# EAGLE design EVAL_USB4155 (EAGLE 7.7.0)
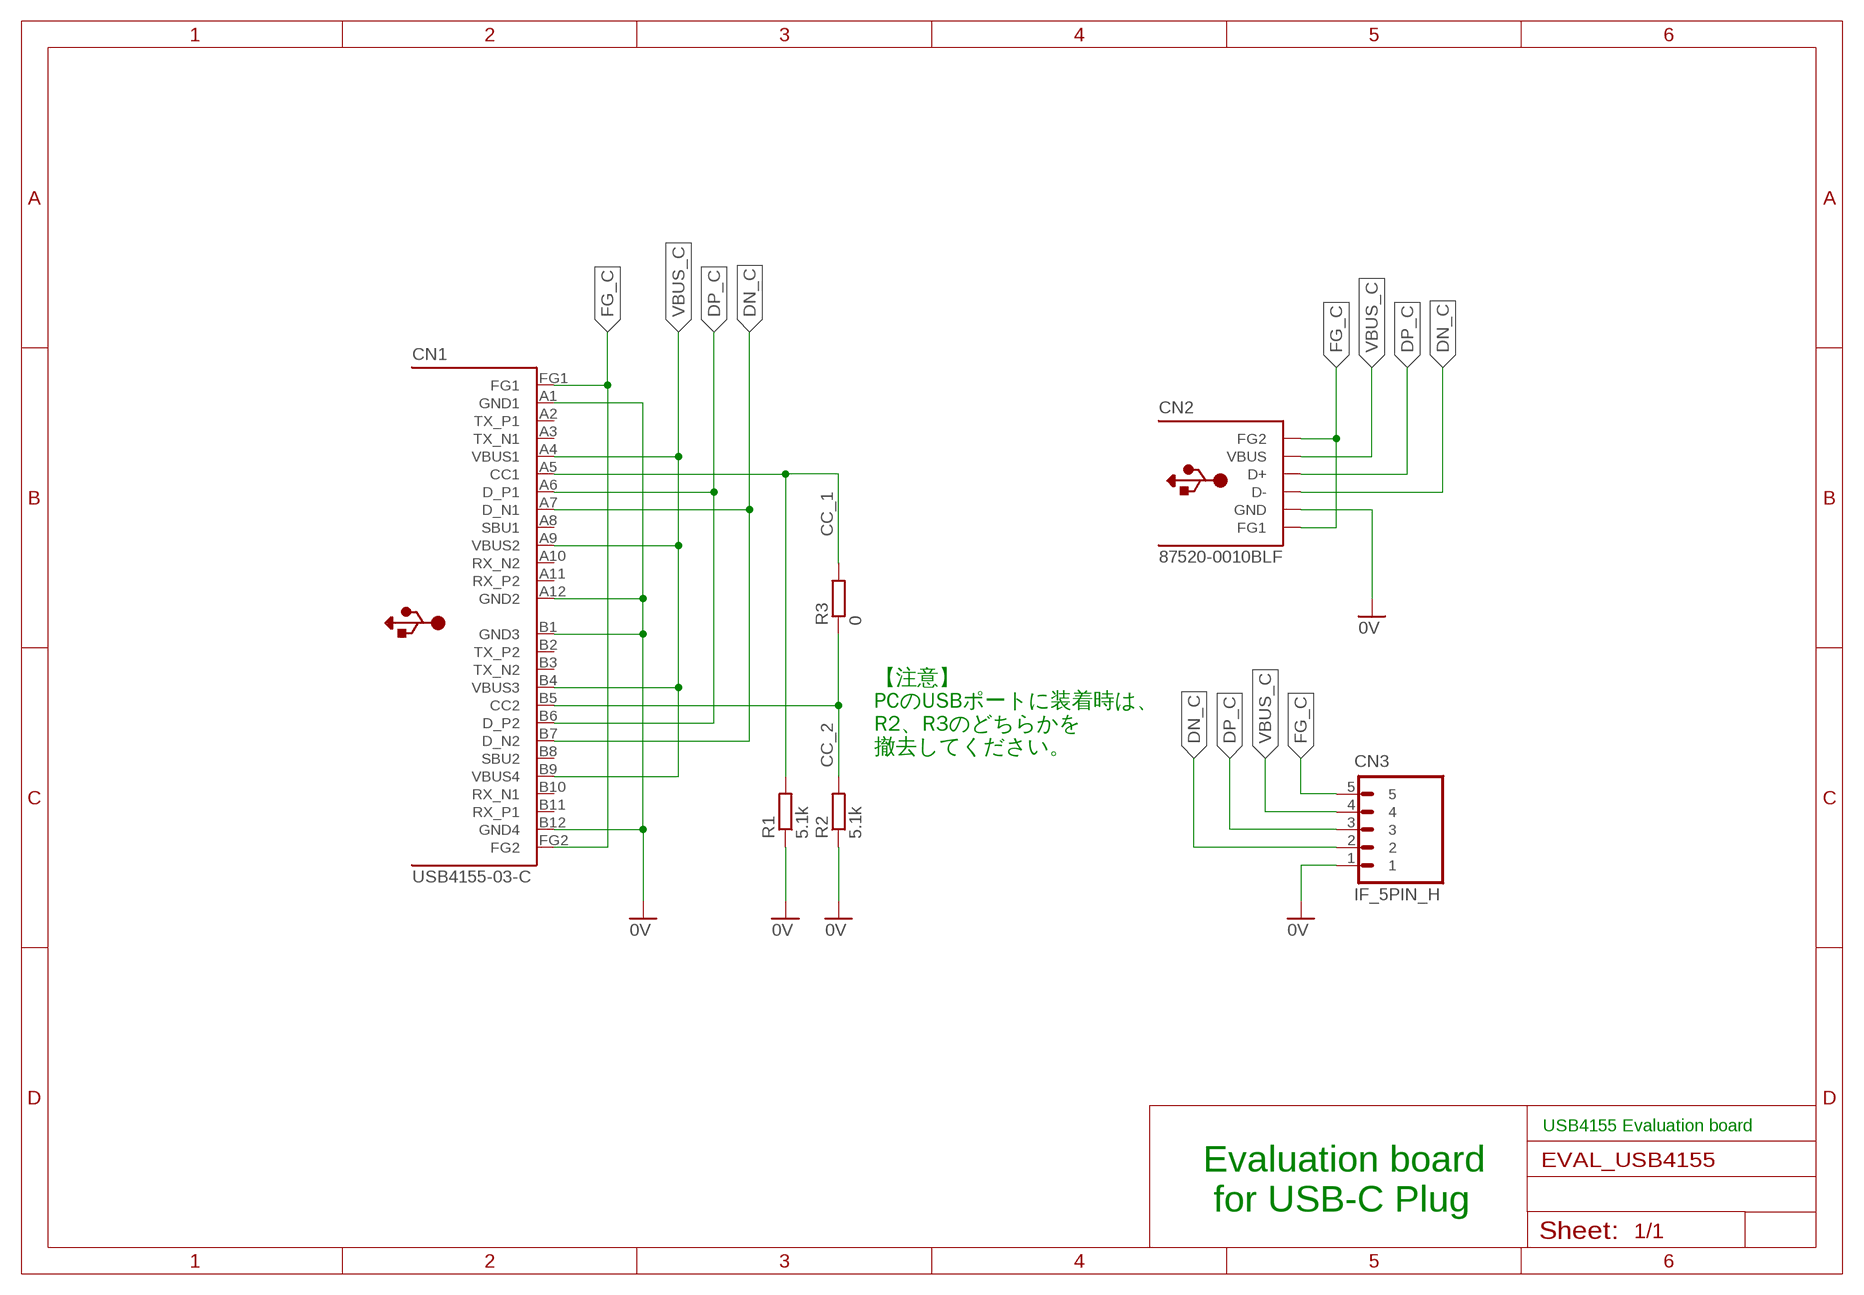
[diagram p0: schematic, sheet 1]

## Parts
CN1  USB4155-03-C  [USB4155-03-C]
CN2  87520-0010BLF  [87520-0010BLF]
CN3  IF_5PIN_H  [HEADER_5PIN]
R1  5.1k  RESISTOR_0402N  [R0402N]
R2  5.1k  RESISTOR_0402N  [R0402N]
R3  0  RESISTOR_0402N  [R0402N]

## Nets
0V: CN1.A1(GND1) CN1.A12(GND2) CN1.B1(GND3) CN1.B12(GND4) CN2.GND CN3.1 R1.1 R2.1
CC_1: CN1.A5(CC1) R1.2 R3.2
CC_2: CN1.B5(CC2) R2.2 R3.1
DN_C: CN1.A7(D_N1) CN1.B7(D_N2) CN2.D- CN3.2
DP_C: CN1.A6(D_P1) CN1.B6(D_P2) CN2.D+ CN3.3
FG_C: CN1.FG1 CN1.FG2 CN2.FG1 CN2.FG2 CN3.5
VBUS_C: CN1.A4(VBUS1) CN1.A9(VBUS2) CN1.B4(VBUS3) CN1.B9(VBUS4) CN2.VBUS CN3.4
Unconnected: CN1.A2(TX_P1) CN1.A3(TX_N1) CN1.A8(SBU1) CN1.A10(RX_N2) CN1.A11(RX_P2) CN1.B2(TX_P2) CN1.B3(TX_N2) CN1.B8(SBU2) CN1.B10(RX_N1) CN1.B11(RX_P1)

## Notes on the sheet
- 【注意】
  PCのUSBポートに装着時は、
  R2、R3のどちらかを
  撤去してください。
- USB4155 Evaluation board
- Evaluation board
   for USB-C Plug

## Library data of the parts
CN1 = Connectors:USB4155-03-C: USB3.2 Gen2 Type C Plug, Horizontal, SMT
CN2 = Connectors:87520-0010BLF: USB Type-A(TM) receptacle
CN3 = Connectors:IF_5PIN: 5-pin インターフェース
R1-R3 = Parts:RESISTOR: 抵抗器

## Board
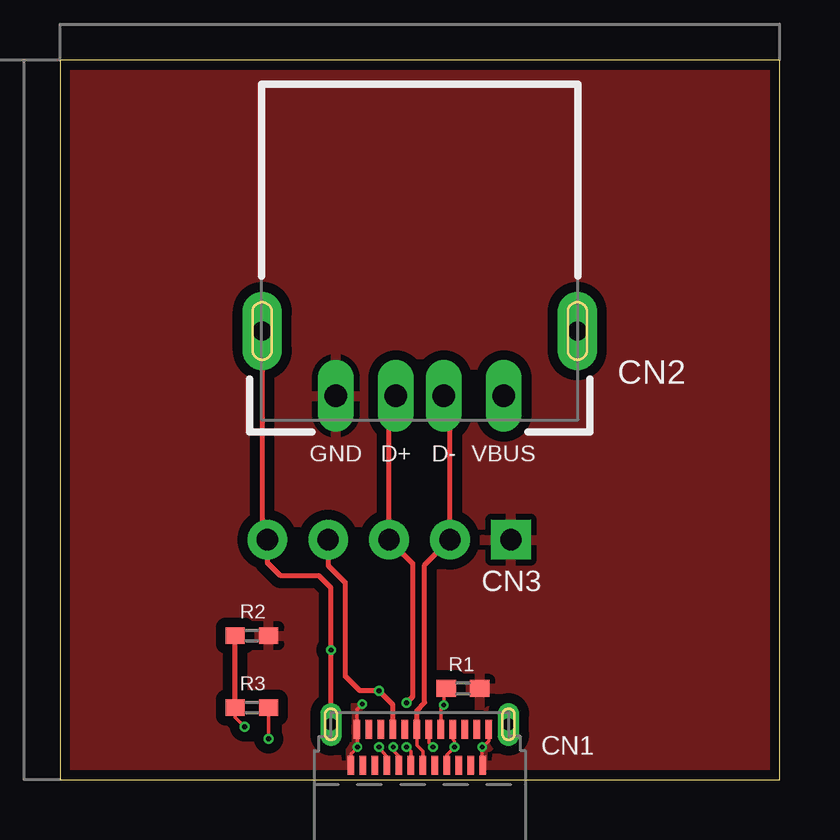
[diagram p1: board, top side]
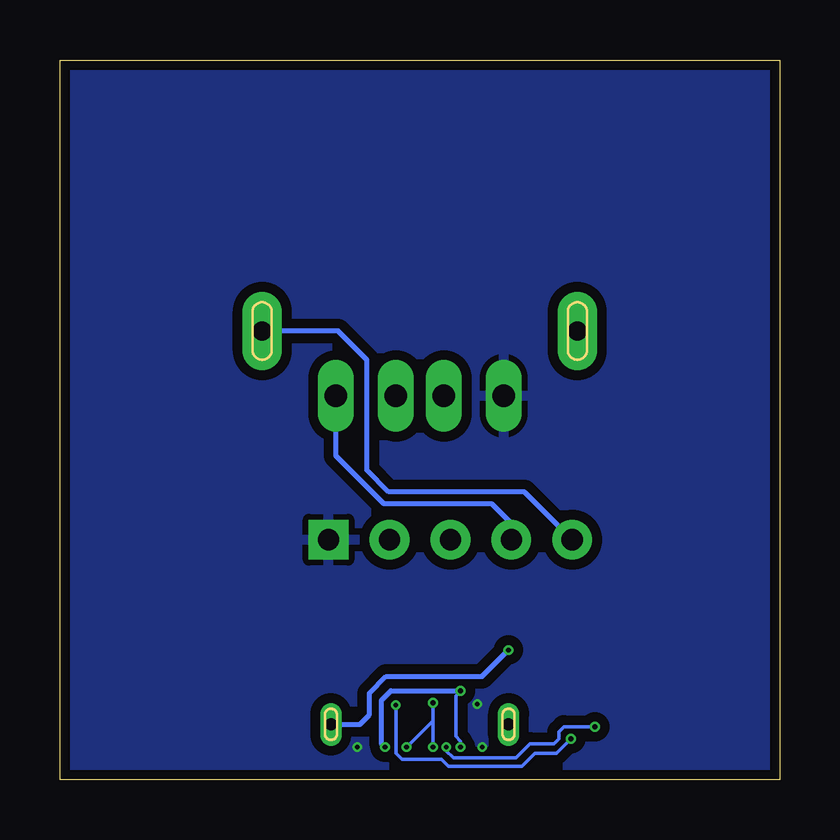
[diagram p2: board, bottom side, seen from below]

Size 30 x 30 mm. Coordinates in mm from the lower left corner, seen from the top.
Outline: 0,0 30,0 30,30 0,30 0,0
Copper layers (1*16): Top 0.035mm / dielectric 1.5mm / Bottom 0.035mm
Design rules "SeeedStudio_2layer_DRU_no_angle_20140221 *": minimum track width 6mil, minimum drill 0.2mm, track to track 0.15mm, track to pad 0.15mm, pad to pad 0.15mm, via to via 0.15mm, smd to smd 0mil, copper to edge 0.2mm, drill to drill 10mil, minimum pad ring 5mil, minimum via ring 0.1mm, stop-mask expansion 2mil, vias tented up to drill 100mil, thermal gap 10mil

### Footprints (pad centres in the part's own frame; a part is rotated, then mirrored left to right if it is on the bottom)
USB4155-03-C = smd 0.28 x 0.8: A1 2.875,2.1; A2 2.375,2.1; A3 1.875,2.1; A4 1.375,2.1; A5 0.875,2.1; A6 0.375,2.1; A7 -0.125,2.1; A8 -0.625,2.1; A9 -1.125,2.1; A10 -1.625,2.1; A11 -2.125,2.1; A12 -2.625,2.1; B1 -2.875,0.6; B2 -2.375,0.6; B3 -1.875,0.6; B4 -1.375,0.6; B5 -0.875,0.6; B6 -0.375,0.6; B7 0.125,0.6; B8 0.625,0.6; B9 1.125,0.6; B10 1.625,0.6; B11 2.125,0.6; B12 2.625,0.6 | drill 0.5 pad 0.9 long: FG1 3.7,2.3; FG2 -3.7,2.3
87520-0010BLF = drill 0.92 pad 1.5 long: D+ -1,0; D- 1,0; GND -3.5,0; VBUS 3.5,0 | drill 0.8 pad 1.64 long: FG1 -6.57,2.7; FG2 6.57,2.7
HEADER_5PIN = drill 0.889 pad 1.651 square: 1 0,0 | drill 0.889 pad 1.651: 2 2.54,0; 3 5.08,0; 4 7.62,0; 5 10.16,0
R0402N = smd 0.8 x 0.7: 1 -0.7,0; 2 0.7,0

### Placement (x,y rotation side)
CN1  15,0 0 top
CN2  15,16 0 top
CN3  18.8,10 180 top
R1  16.8,3.8 180 top
R2  8,6 180 top
R3  8,3 0 top

### Tracks (layer width: path | path; a pad name or v marks a point on that pad's centre or on a via)
0V  (via drill 0.2)
  Top 0.152: CN1.B12 17.6,0.62 v17.6,1.35 17.88,1.62 CN1.A1 | CN1.B1 12.12,1.07 v12.4,1.35 12.4,2.08 CN1.A12 12.38,2.92 v12.6,3.15
  pour Bottom (isolate 0.406, rank 3): -1,31 31,31 31,-1 -1,-1
  pour Top (isolate 0.406): -0.5,-0.5 30.5,-0.5 30.5,30.5 -0.5,30.5
CC_1  (via drill 0.2)
  Top 0.152: CN1.A5 15.88,2.98 v16,3.1 16,3.7 R1.2 | R3.2 v8.7,1.7
  Bottom 0.152: v16,3.1 16,1.1 15.75,0.85 14.1,0.85 13.8,0.55 10.75,0.55 10.2,1.1 9.3,1.1 v8.7,1.7
CC_2  (via drill 0.2)
  Top 0.152: CN1.B5 14.12,0.97 13.9,1.2 v13.9,1.35 | R3.1 7.3,2.6 v7.7,2.2
  Top 0.203: R3.1 R2.2
  Bottom 0.152: v13.9,1.35 13.9,1.2 13.6,0.9 11,0.9 10.4,1.5 9.4,1.5 9.2,1.7 9.2,2 9,2.2 v7.7,2.2
DN_C
  Top 0.152: CN1.B7 15.12,1.18 14.88,1.43 CN1.A7
  Top 0.203: CN1.A7 14.88,2.88 15.2,3.2 15.2,8.94 CN3.2 16.26,15.74 CN2.D-
DP_C  (via drill 0.2)
  Top 0.152: CN1.B6 14.62,1.18 v14.45,1.35 | v15.55,1.35 15.38,1.52 CN1.A6
  Top 0.203: CN2.D+ 13.72,15.72 CN3.3 14.7,9.02 14.7,3.45 v14.45,3.2
  Bottom 0.152: v14.45,3.2 14.45,2.45 | 14.45,2.45 v14.45,1.35 | v15.55,1.35 14.45,2.45
FG_C  (via drill 0.2)
  Top 0.203: CN1.FG2 v11.3,5.4 11.3,8 10.8,8.5 9.2,8.5 8.64,9.06 CN3.5 8.43,10.21 CN2.FG1
  Bottom 0.203: CN2.FG2 18.4,18.7 17.2,17.5 17.2,12.9 16.3,12 10.64,12 CN3.5 | CN1.FG1 17.5,2.3 17.1,2.7 17.1,3.6 16.4,4.3 12.4,4.3 v11.3,5.4
VBUS_C  (via drill 0.2)
  Top 0.152: CN1.B4 13.6,0.62 13.6,1 v13.3,1.35 | CN1.B9 16.12,1.02 v16.45,1.35 16.45,1.6 16.38,1.68 CN1.A4
  Top 0.203: CN3.4 11.18,8.92 11.9,8.2 11.9,4.3 12.5,3.7 v13.3,3.7 13.88,3.12 CN1.A9
  Bottom 0.152: v13.3,1.35 13.3,1.6 13.5,1.8 13.5,3.5 v13.3,3.7
  Bottom 0.203: CN3.4 11.18,10.68 12,11.5 16.5,11.5 18.5,13.5 CN2.VBUS | v16.45,1.35 16.6,1.5 16.6,3.3 16.2,3.7 v13.3,3.7